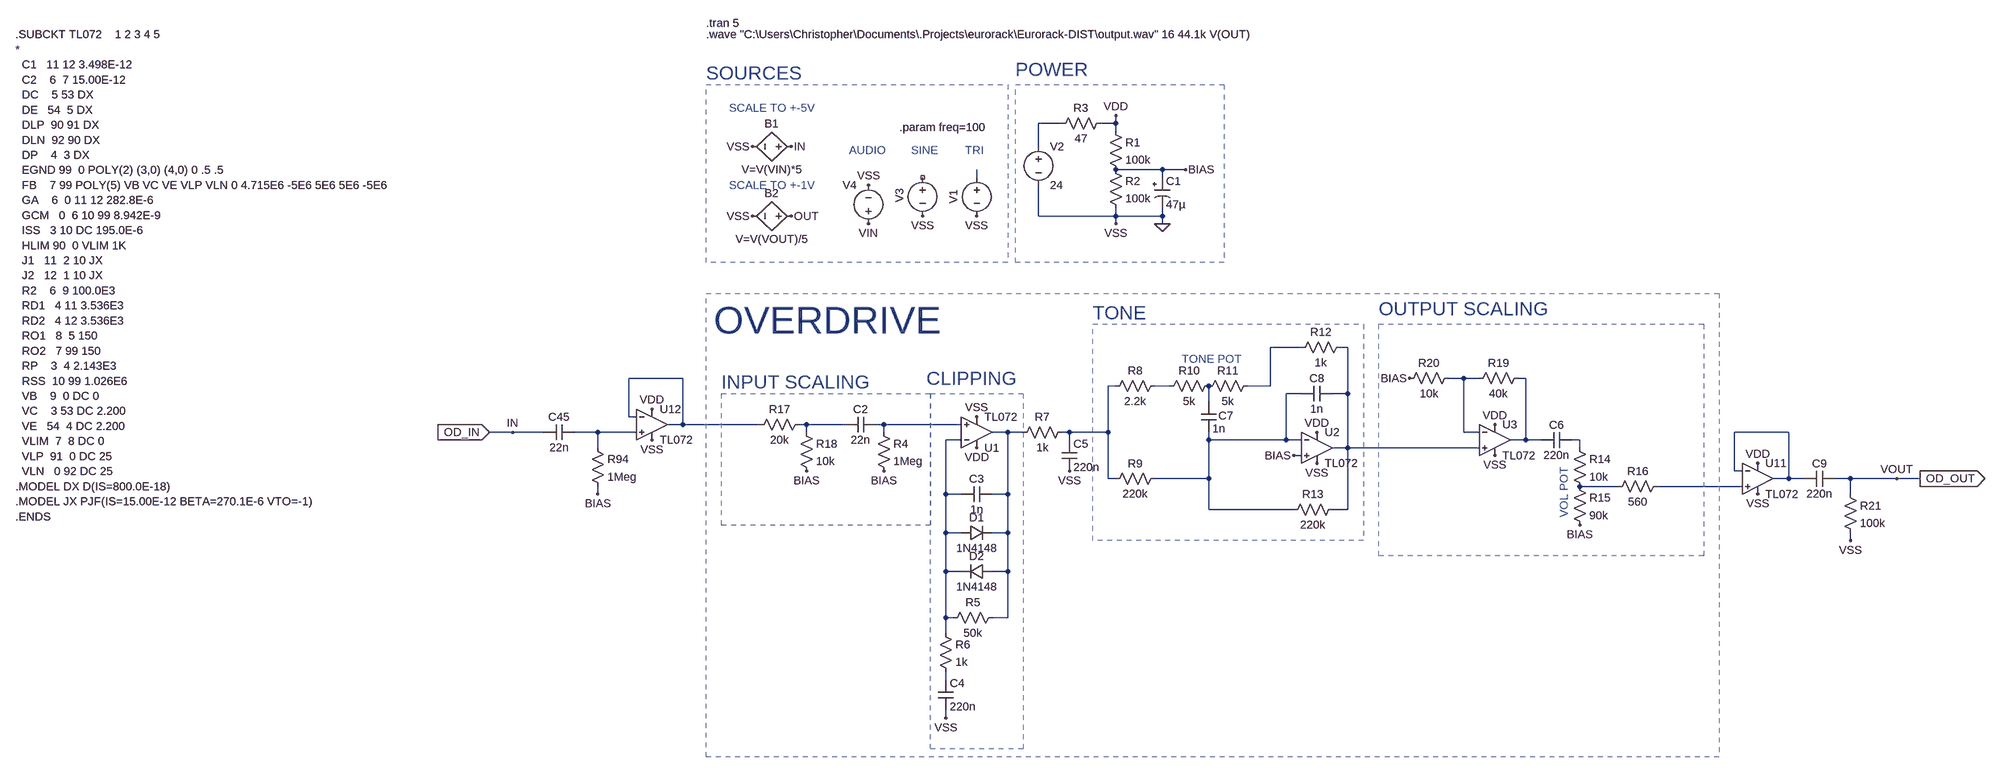
[diagram p0: schematic combined.asc]
combined.asc, the LTspice schematic file:
Version 4.1
SHEET 1 3304 5492
WIRE 144 -112 96 -112
WIRE 256 -112 256 -128
WIRE 256 -112 224 -112
WIRE 256 -96 256 -112
WIRE 96 -64 96 -112
WIRE 352 -16 256 -16
WIRE 400 -16 352 -16
WIRE -32 0 -32 -16
WIRE 352 0 352 -16
WIRE 96 80 96 16
WIRE 256 80 256 64
WIRE 256 80 96 80
WIRE 352 80 352 64
WIRE 352 80 256 80
WIRE 256 96 256 80
WIRE 352 96 352 80
WIRE 640 352 576 352
WIRE 736 352 720 352
WIRE -640 416 -752 416
WIRE 976 416 944 416
WIRE 1008 416 976 416
WIRE 1104 416 1088 416
WIRE 256 432 240 432
WIRE 368 432 336 432
WIRE 576 432 576 352
WIRE 576 432 528 432
WIRE 640 448 608 448
WIRE 736 448 736 352
WIRE 736 448 704 448
WIRE 448 464 448 432
WIRE -752 496 -752 416
WIRE -736 496 -752 496
WIRE -640 512 -640 416
WIRE -640 512 -672 512
WIRE -480 512 -640 512
WIRE -384 512 -400 512
WIRE -304 512 -384 512
WIRE -224 512 -240 512
WIRE -64 512 -224 512
WIRE -992 528 -1040 528
WIRE -928 528 -992 528
WIRE -816 528 -864 528
WIRE -736 528 -816 528
WIRE -384 528 -384 512
WIRE -224 528 -224 512
WIRE 32 528 0 528
WIRE 64 528 32 528
WIRE 160 528 144 528
WIRE 240 528 240 432
WIRE 240 528 160 528
WIRE 976 528 976 416
WIRE 1008 528 976 528
WIRE 1648 528 1536 528
WIRE -64 544 -96 544
WIRE 160 544 160 528
WIRE 448 544 448 528
WIRE 608 544 608 448
WIRE 608 544 448 544
WIRE 640 544 608 544
WIRE 1104 544 1104 416
WIRE 1104 544 1072 544
WIRE 1136 544 1104 544
WIRE 1216 544 1200 544
WIRE -816 560 -816 528
WIRE 736 560 736 448
WIRE 736 560 704 560
WIRE 1008 560 736 560
WIRE 1216 560 1216 544
WIRE 640 576 624 576
WIRE 1536 608 1536 528
WIRE 1552 608 1536 608
WIRE 240 624 240 528
WIRE 256 624 240 624
WIRE 448 624 448 544
WIRE 448 624 336 624
WIRE 1648 624 1648 528
WIRE 1648 624 1616 624
WIRE 1680 624 1648 624
WIRE 1776 624 1744 624
WIRE 1872 624 1776 624
WIRE 1920 624 1872 624
WIRE 1296 640 1216 640
WIRE 1552 640 1376 640
WIRE -816 656 -816 640
WIRE -96 656 -96 544
WIRE -64 656 -96 656
WIRE 32 656 32 528
WIRE 32 656 0 656
WIRE 1776 656 1776 624
WIRE 448 688 448 624
WIRE 624 688 448 688
WIRE 736 688 736 560
WIRE 736 688 704 688
WIRE -96 736 -96 656
WIRE -64 736 -96 736
WIRE 32 736 32 656
WIRE 32 736 0 736
WIRE 1776 752 1776 736
WIRE -96 816 -96 736
WIRE -64 816 -96 816
WIRE 32 816 32 736
WIRE 32 816 0 816
WIRE -96 912 -96 816
WIRE -80 912 -96 912
WIRE 32 912 32 816
WIRE 32 912 0 912
WIRE -96 944 -96 912
WIRE -96 1040 -96 1024
WIRE -96 1120 -96 1104
FLAG -32 80 VSS
FLAG 400 -16 BIAS
FLAG 256 96 VSS
FLAG 256 -128 VDD
FLAG 352 96 0
FLAG -144 80 VSS
FLAG -256 16 VSS
FLAG -256 96 VIN
FLAG -496 -64 VSS
FLAG -416 -64 IN
FLAG -496 80 VSS
FLAG -416 80 OUT
FLAG -224 608 BIAS
FLAG -32 496 VSS
FLAG -32 560 VDD
FLAG -96 1120 VSS
FLAG 160 608 VSS
FLAG 624 576 BIAS
FLAG 672 592 VSS
FLAG 672 528 VDD
FLAG -384 608 BIAS
FLAG 1040 512 VDD
FLAG 1040 576 VSS
FLAG 864 416 BIAS
FLAG 1584 592 VDD
FLAG 1584 656 VSS
FLAG 1920 624 OD_OUT
IOPIN 1920 624 Out
FLAG -704 480 VDD
FLAG -704 544 VSS
FLAG -1040 528 OD_IN
IOPIN -1040 528 In
FLAG -992 528 IN
FLAG 1872 624 VOUT
FLAG -816 656 BIAS
FLAG 1216 720 BIAS
FLAG 1776 752 VSS
SYMBOL voltage -32 -16 R0
WINDOW 0 -32 56 VBottom 2
WINDOW 3 32 56 Invisible 2
WINDOW 123 0 0 Left 0
WINDOW 39 0 0 Left 0
SYMATTR InstName V1
SYMATTR Value PULSE(0 250m 0 {0.5/freq} {0.5/freq} 0 {1/freq})
SYMBOL voltage 96 -80 R0
WINDOW 123 0 0 Left 0
WINDOW 39 0 0 Left 0
SYMATTR InstName V2
SYMATTR Value 24
SYMBOL res 240 -112 R0
SYMATTR InstName R1
SYMATTR Value 100k
SYMBOL res 240 -32 R0
SYMATTR InstName R2
SYMATTR Value 100k
SYMBOL polcap 336 0 R0
SYMATTR InstName C1
SYMATTR Value 47µ
SYMBOL res 240 -128 R90
WINDOW 0 0 56 VBottom 2
WINDOW 3 32 56 VTop 2
SYMATTR InstName R3
SYMATTR Value 47
SYMBOL voltage -144 -16 R0
WINDOW 0 -47 39 VRight 2
WINDOW 3 24 96 Invisible 2
WINDOW 123 0 0 Left 0
WINDOW 39 0 0 Left 0
SYMATTR InstName V3
SYMATTR Value SINE(0 1 {freq})
SYMBOL voltage -256 112 R180
WINDOW 0 24 96 Left 2
WINDOW 3 24 68 Invisible 2
SYMATTR InstName V4
SYMATTR Value WAVEFILE="C:\Users\Christopher\Documents\.Projects\eurorack\Eurorack-DIST\input.wav" chan=0
SYMBOL bv -400 -64 R90
WINDOW 0 -32 56 VBottom 2
WINDOW 3 32 56 VTop 2
SYMATTR InstName B1
SYMATTR Value V=V(VIN)*5
SYMBOL bv -400 80 R90
WINDOW 0 -32 56 VBottom 2
WINDOW 3 32 56 VTop 2
SYMATTR InstName B2
SYMATTR Value V=V(VOUT)/5
SYMBOL cap -240 496 R90
WINDOW 0 0 32 VBottom 2
WINDOW 3 32 32 VTop 2
SYMATTR InstName C2
SYMATTR Value 22n
SYMBOL res -240 512 R0
SYMATTR InstName R4
SYMATTR Value 1Meg
SYMBOL OpAmps\\opamp2 -32 592 M180
SYMATTR InstName U1
SYMATTR Value TL072
SYMBOL cap 0 640 R90
WINDOW 0 0 32 VBottom 2
WINDOW 3 32 32 VTop 2
SYMATTR InstName C3
SYMATTR Value 1n
SYMBOL diode -64 752 R270
WINDOW 0 32 32 VTop 2
WINDOW 3 0 32 VBottom 2
SYMATTR InstName D1
SYMATTR Value 1N4148
SYMBOL diode 0 800 R90
WINDOW 0 0 32 VBottom 2
WINDOW 3 32 32 VTop 2
SYMATTR InstName D2
SYMATTR Value 1N4148
SYMBOL res 16 896 R90
WINDOW 0 0 56 VBottom 2
WINDOW 3 32 56 VTop 2
SYMATTR InstName R5
SYMATTR Value 50k
SYMBOL res -112 928 R0
SYMATTR InstName R6
SYMATTR Value 1k
SYMBOL cap -112 1040 R0
SYMATTR InstName C4
SYMATTR Value 220n
SYMBOL res 160 512 R90
WINDOW 0 0 56 VBottom 2
WINDOW 3 32 56 VTop 2
SYMATTR InstName R7
SYMATTR Value 1k
SYMBOL cap 144 544 R0
SYMATTR InstName C5
SYMATTR Value 220n
SYMBOL cap 1200 528 R90
WINDOW 0 0 32 VBottom 2
WINDOW 3 32 32 VTop 2
SYMATTR InstName C6
SYMATTR Value 220n
SYMBOL res 352 416 R90
WINDOW 0 0 56 VBottom 2
WINDOW 3 32 56 VTop 2
SYMATTR InstName R8
SYMATTR Value 2.2k
SYMBOL res 352 608 R90
WINDOW 0 0 56 VBottom 2
WINDOW 3 32 56 VTop 2
SYMATTR InstName R9
SYMATTR Value 220k
SYMBOL res 464 416 R90
WINDOW 0 0 56 VBottom 2
WINDOW 3 32 56 VTop 2
SYMATTR InstName R10
SYMATTR Value 5k
SYMBOL res 544 416 R90
WINDOW 0 0 56 VBottom 2
WINDOW 3 32 56 VTop 2
SYMATTR InstName R11
SYMATTR Value 5k
SYMBOL cap 432 464 R0
WINDOW 0 36 30 Left 2
SYMATTR InstName C7
SYMATTR Value 1n
SYMBOL OpAmps\\opamp2 672 496 R0
SYMATTR InstName U2
SYMATTR Value TL072
SYMBOL cap 704 432 R90
WINDOW 0 0 32 VBottom 2
WINDOW 3 32 32 VTop 2
SYMATTR InstName C8
SYMATTR Value 1n
SYMBOL res 736 336 R90
WINDOW 0 0 56 VBottom 2
WINDOW 3 32 56 VTop 2
SYMATTR InstName R12
SYMATTR Value 1k
SYMBOL res 720 672 R90
WINDOW 0 0 56 VBottom 2
WINDOW 3 32 56 VTop 2
SYMATTR InstName R13
SYMATTR Value 220k
SYMBOL res 1200 544 R0
SYMATTR InstName R14
SYMATTR Value 10k
SYMBOL res 1200 624 R0
SYMATTR InstName R15
SYMATTR Value 90k
SYMBOL res 1392 624 R90
WINDOW 0 0 56 VBottom 2
WINDOW 3 32 56 VTop 2
SYMATTR InstName R16
SYMATTR Value 560
SYMBOL res -384 496 R90
WINDOW 0 0 56 VBottom 2
WINDOW 3 32 56 VTop 2
SYMATTR InstName R17
SYMATTR Value 20k
SYMBOL res -400 512 R0
SYMATTR InstName R18
SYMATTR Value 10k
SYMBOL OpAmps\\opamp2 1040 480 R0
SYMATTR InstName U3
SYMATTR Value TL072
SYMBOL res 1104 400 R90
WINDOW 0 0 56 VBottom 2
WINDOW 3 32 56 VTop 2
SYMATTR InstName R19
SYMATTR Value 40k
SYMBOL res 960 400 R90
WINDOW 0 0 56 VBottom 2
WINDOW 3 32 56 VTop 2
SYMATTR InstName R20
SYMATTR Value 10k
SYMBOL OpAmps\\opamp2 1584 560 R0
SYMATTR InstName U11
SYMATTR Value TL072
SYMBOL OpAmps\\opamp2 -704 448 R0
SYMATTR InstName U12
SYMATTR Value TL072
SYMBOL cap -864 512 R90
WINDOW 0 0 32 VBottom 2
WINDOW 3 32 32 VTop 2
SYMATTR InstName C45
SYMATTR Value 22n
SYMBOL res -832 544 R0
SYMATTR InstName R94
SYMATTR Value 1Meg
SYMBOL cap 1744 608 R90
WINDOW 0 0 32 VBottom 2
WINDOW 3 32 32 VTop 2
SYMATTR InstName C9
SYMATTR Value 220n
SYMBOL res 1760 640 R0
SYMATTR InstName R21
SYMATTR Value 100k
TEXT -192 -104 Left 2 !.param freq=100
TEXT -168 -56 Left 2 ;SINE
TEXT -56 -56 Left 2 ;TRI
TEXT -296 -56 Left 2 ;AUDIO
TEXT -592 -216 Left 4 ;SOURCES
TEXT 48 -224 Left 4 ;POWER
TEXT -544 -144 Left 2 ;SCALE TO +-5V
TEXT -544 16 Left 2 ;SCALE TO +-1V
TEXT -592 -320 Left 2 !.tran 5
TEXT -592 -296 Left 2 !.wave "C:\\Users\\Christopher\\Documents\\.Projects\\eurorack\\Eurorack-DIST\\output.wav" 16 44.1k V(OUT)
TEXT -2296 -296 Left 2 !.SUBCKT TL072    1 2 3 4 5\n*\n  C1   11 12 3.498E-12\n  C2    6  7 15.00E-12\n  DC    5 53 DX\n  DE   54  5 DX\n  DLP  90 91 DX\n  DLN  92 90 DX\n  DP    4  3 DX\n  EGND 99  0 POLY(2) (3,0) (4,0) 0 .5 .5\n  FB    7 99 POLY(5) VB VC VE VLP VLN 0 4.715E6 -5E6 5E6 5E6 -5E6\n  GA    6  0 11 12 282.8E-6\n  GCM   0  6 10 99 8.942E-9\n  ISS   3 10 DC 195.0E-6\n  HLIM 90  0 VLIM 1K\n  J1   11  2 10 JX\n  J2   12  1 10 JX\n  R2    6  9 100.0E3\n  RD1   4 11 3.536E3\n  RD2   4 12 3.536E3\n  RO1   8  5 150\n  RO2   7 99 150\n  RP    3  4 2.143E3\n  RSS  10 99 1.026E6\n  VB    9  0 DC 0\n  VC    3 53 DC 2.200\n  VE   54  4 DC 2.200\n  VLIM  7  8 DC 0\n  VLP  91  0 DC 25\n  VLN   0 92 DC 25\n.MODEL DX D(IS=800.0E-18)\n.MODEL JX PJF(IS=15.00E-12 BETA=270.1E-6 VTO=-1)\n.ENDS
TEXT 392 376 Left 2 ;TONE POT
TEXT 1184 600 VRight 2 ;VOL POT
TEXT -560 424 Left 4 ;INPUT SCALING
TEXT -136 416 Left 4 ;CLIPPING
TEXT 208 280 Left 4 ;TONE
TEXT 800 272 Left 4 ;OUTPUT SCALING
TEXT -576 296 Left 6 ;OVERDRIVE
RECTANGLE Normal 480 176 48 -192 1
RECTANGLE Normal 32 176 -592 -192 1
RECTANGLE Normal -128 720 -560 448 1
RECTANGLE Normal 64 1184 -128 448 1
RECTANGLE Normal 768 752 208 304 1
RECTANGLE Normal 1472 784 800 304 1
RECTANGLE Normal 1504 1200 -592 240 3

The netlist it stands for:
* combined.asc
V1 N002 0 PULSE(0 250m 0 {0.5/freq} {0.5/freq} 0 {1/freq})
V2 N001 0 24
R1 VDD BIAS 100k
R2 BIAS 0 100k
C1 BIAS 0 47µ
R3 VDD N001 47
V3 NC_01 0 SINE(0 1 {freq})
V4 VIN 0 WAVEFILE="C:\Users\Christopher\Documents\.Projects\eurorack\Eurorack-DIST\input.wav" chan=0
B1 OD_IN 0 V=V(VIN)*5
B2 OUT 0 V=V(VOUT)/5
C2 N013 N012 22n
R4 N013 BIAS 1Meg
X§U1 N013 N017 VDD 0 N015 TL072  ; pins In+ In- V+ V- OUT
C3 N015 N017 1n
D1 N017 N015 1N4148
D2 N015 N017 1N4148
R5 N015 N017 50k
R6 N017 N021 1k
C4 N021 0 220n
R7 N008 N015 1k
C5 N008 0 220n
C6 N018 N007 220n
R8 N009 N008 2.2k
R9 N010 N008 220k
R10 N011 N009 5k
R11 N003 N011 5k
C7 N011 N010 1n
X§U2 BIAS N010 VDD 0 N004 TL072  ; pins In+ In- V+ V- OUT
C8 N004 N010 1n
R12 N004 N003 1k
R13 N004 N010 220k
R14 N018 N019 10k
R15 N019 BIAS 90k
R16 N020 N019 560
R17 N012 N005 20k
R18 N012 BIAS 10k
X§U3 N004 N006 VDD 0 N007 TL072  ; pins In+ In- V+ V- OUT
R19 N007 N006 40k
R20 N006 BIAS 10k
X§U11 N020 N016 VDD 0 N016 TL072  ; pins In+ In- V+ V- OUT
X§U12 N014 N005 VDD 0 N005 TL072  ; pins In+ In- V+ V- OUT
C45 N014 OD_IN 22n
R94 N014 BIAS 1Meg
C9 VOUT N016 220n
R21 VOUT 0 100k
.model D D
.lib standard.dio
.param freq=100
* SINE
* TRI
* AUDIO
* SOURCES
* POWER
* SCALE TO +-5V
* SCALE TO +-1V
.tran 5
.wave "C:\Users\Christopher\Documents\.Projects\eurorack\Eurorack-DIST\output.wav" 16 44.1k V(OUT)
.SUBCKT TL072    1 2 3 4 5
*
  C1   11 12 3.498E-12
  C2    6  7 15.00E-12
  DC    5 53 DX
  DE   54  5 DX
  DLP  90 91 DX
  DLN  92 90 DX
  DP    4  3 DX
  EGND 99  0 POLY(2) (3,0) (4,0) 0 .5 .5
  FB    7 99 POLY(5) VB VC VE VLP VLN 0 4.715E6 -5E6 5E6 5E6 -5E6
  GA    6  0 11 12 282.8E-6
  GCM   0  6 10 99 8.942E-9
  ISS   3 10 DC 195.0E-6
  HLIM 90  0 VLIM 1K
  J1   11  2 10 JX
  J2   12  1 10 JX
  R2    6  9 100.0E3
  RD1   4 11 3.536E3
  RD2   4 12 3.536E3
  RO1   8  5 150
  RO2   7 99 150
  RP    3  4 2.143E3
  RSS  10 99 1.026E6
  VB    9  0 DC 0
  VC    3 53 DC 2.200
  VE   54  4 DC 2.200
  VLIM  7  8 DC 0
  VLP  91  0 DC 25
  VLN   0 92 DC 25
.MODEL DX D(IS=800.0E-18)
.MODEL JX PJF(IS=15.00E-12 BETA=270.1E-6 VTO=-1)
.ENDS
* TONE POT
* VOL POT
* INPUT SCALING
* CLIPPING
* TONE
* OUTPUT SCALING
* OVERDRIVE
.backanno
.end